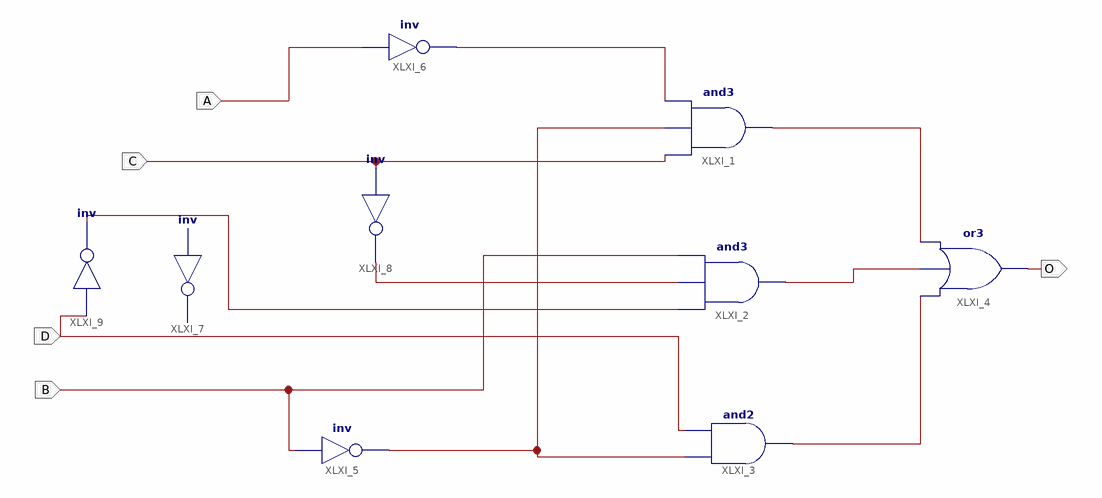
[diagram p0: schematic sheet 1]
// Xilinx ISE schematic lab7_A1.sch (spartan3e) as structural Verilog: 9 symbols, 5 ports
module lab7_A1 (
  input  D,
  input  A,
  input  B,
  input  C,
  output O
);

  wire XLXN_12, XLXN_16, XLXN_17, XLXN_23, XLXN_25, XLXN_26, XLXN_27;

  and XLXI_1 (XLXN_16, C, XLXN_27, XLXN_26);
  and XLXI_2 (XLXN_12, XLXN_23, XLXN_25, B);
  and XLXI_3 (XLXN_17, XLXN_27, D);
  or XLXI_4 (O, XLXN_17, XLXN_12, XLXN_16);
  not XLXI_5 (XLXN_27, B);
  not XLXI_6 (XLXN_26, A);
  // inv XLXI_7 is placed but not wired
  not XLXI_8 (XLXN_25, C);
  not XLXI_9 (XLXN_23, D);
endmodule
